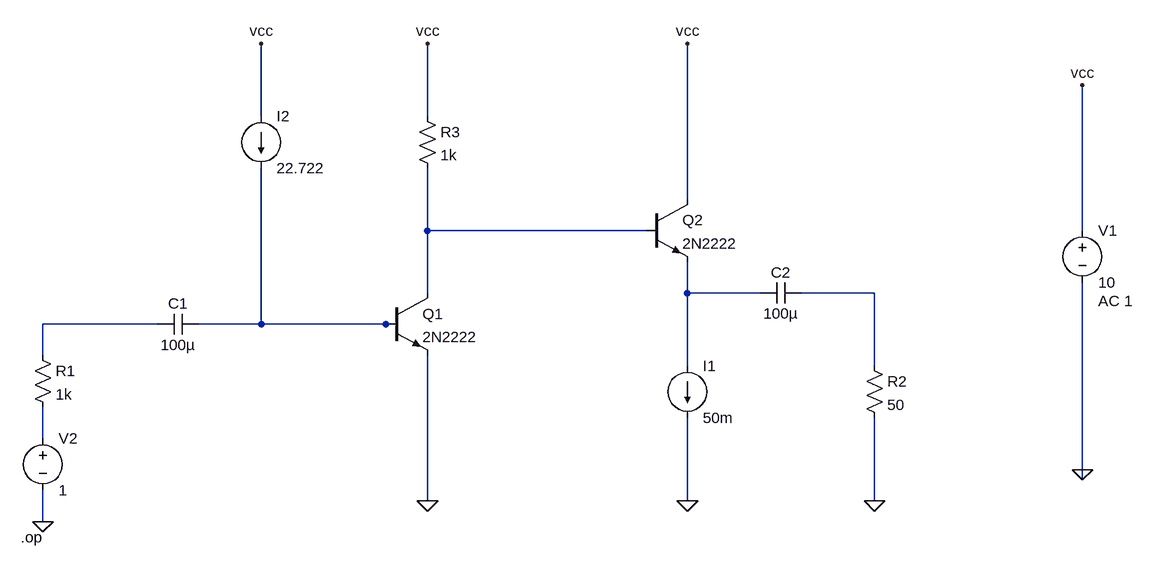
[diagram p0: schematic meros 2o A).asc]
meros 2o A).asc, the LTspice schematic file:
Version 4
SHEET 1 944 744
WIRE -400 80 -400 -32
WIRE -144 80 -144 -32
WIRE 256 208 256 -32
WIRE -144 256 -144 160
WIRE 192 256 -144 256
WIRE 864 256 864 32
WIRE -144 352 -144 256
WIRE 256 352 256 304
WIRE 368 352 256 352
WIRE 544 352 432 352
WIRE -560 400 -736 400
WIRE -400 400 -400 160
WIRE -400 400 -496 400
WIRE -208 400 -400 400
WIRE -192 400 -208 400
WIRE -736 448 -736 400
WIRE 256 464 256 352
WIRE 544 464 544 352
WIRE -736 576 -736 528
WIRE 864 624 864 336
WIRE 864 640 864 624
WIRE -144 672 -144 448
WIRE 256 672 256 544
WIRE 544 672 544 544
WIRE -736 704 -736 656
FLAG 256 672 0
FLAG 544 672 0
FLAG -736 704 0
FLAG 864 624 0
FLAG -144 -32 vcc
FLAG 256 -32 vcc
FLAG -400 -32 vcc
FLAG 864 32 vcc
FLAG -144 672 0
SYMBOL npn 192 208 R0
SYMATTR InstName Q2
SYMATTR Value 2N2222
SYMBOL npn -208 352 R0
SYMATTR InstName Q1
SYMATTR Value 2N2222
SYMBOL res -160 64 R0
SYMATTR InstName R3
SYMATTR Value 1k
SYMBOL res 528 448 R0
SYMATTR InstName R2
SYMATTR Value 50
SYMBOL res -752 432 R0
SYMATTR InstName R1
SYMATTR Value 1k
SYMBOL cap -496 384 R90
WINDOW 0 0 32 VBottom 2
WINDOW 3 32 32 VTop 2
SYMATTR InstName C1
SYMATTR Value 100µ
SYMBOL cap 432 336 R90
WINDOW 0 0 32 VBottom 2
WINDOW 3 32 32 VTop 2
SYMATTR InstName C2
SYMATTR Value 100µ
SYMBOL current 256 464 R0
WINDOW 123 0 0 Left 0
WINDOW 39 0 0 Left 0
SYMATTR InstName I1
SYMATTR Value 50m
SYMBOL current -400 80 R0
WINDOW 123 0 0 Left 0
WINDOW 39 0 0 Left 0
SYMATTR InstName I2
SYMATTR Value 22.722
SYMBOL voltage 864 240 R0
WINDOW 123 24 124 Left 2
WINDOW 39 0 0 Left 0
SYMATTR Value2 AC 1
SYMATTR InstName V1
SYMATTR Value 10
SYMBOL voltage -736 560 R0
WINDOW 123 0 0 Left 0
WINDOW 39 0 0 Left 0
SYMATTR InstName V2
SYMATTR Value 1
TEXT -770 728 Left 2 !.op

The netlist it stands for:
* meros 2o A).asc
Q2 vcc N001 N002 0 2N2222
Q1 N001 N005 0 0 2N2222
R3 vcc N001 1k
R2 N003 0 50
R1 N004 N006 1k
C1 N005 N004 100µ
C2 N003 N002 100µ
I1 N002 0 50m
I2 vcc N005 22.722
V1 vcc 0 10 AC 1
V2 N006 0 1
.model NPN NPN
.model PNP PNP
.lib standard.bjt
.op
.backanno
.end